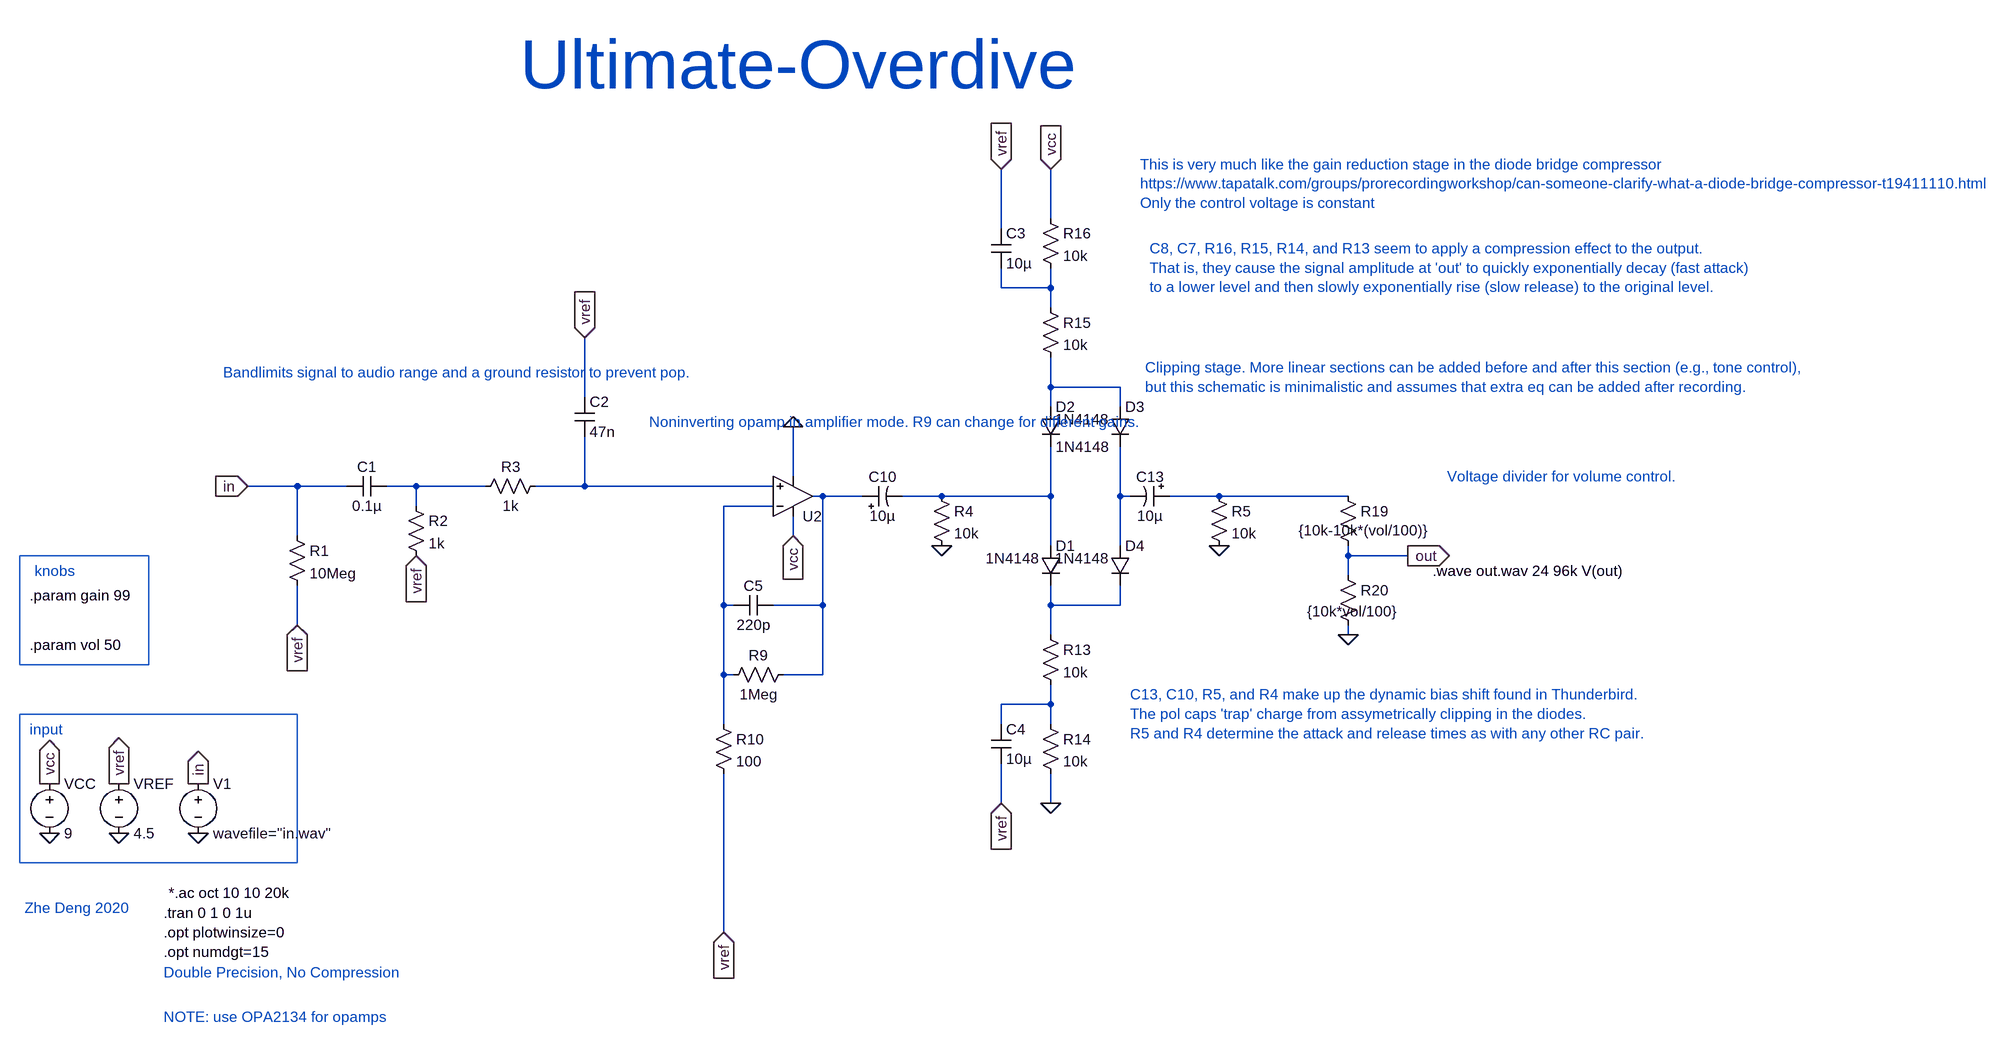
[diagram p0: schematic Ultimate-Overdrive_OLD.asc]
Ultimate-Overdrive_OLD.asc, the LTspice schematic file:
Version 4
SHEET 1 149556 120332
WIRE 146384 115584 146384 115504
WIRE 146304 115600 146304 115504
WIRE 146304 115696 146304 115664
WIRE 146384 115696 146384 115664
WIRE 146384 115696 146304 115696
WIRE 146384 115728 146384 115696
WIRE 146384 115856 146384 115808
WIRE 146496 115856 146384 115856
WIRE 145632 115872 145632 115776
WIRE 146384 115888 146384 115856
WIRE 146496 115888 146496 115856
WIRE 145968 116000 145968 115920
WIRE 145168 116016 145088 116016
WIRE 145248 116016 145168 116016
WIRE 145360 116016 145312 116016
WIRE 145472 116016 145360 116016
WIRE 145632 116016 145632 115936
WIRE 145632 116016 145552 116016
WIRE 145936 116016 145632 116016
WIRE 146016 116032 146000 116032
WIRE 146080 116032 146016 116032
WIRE 146208 116032 146144 116032
WIRE 146384 116032 146384 115952
WIRE 146384 116032 146208 116032
WIRE 146496 116032 146496 115952
WIRE 146512 116032 146496 116032
WIRE 146656 116032 146576 116032
WIRE 146864 116032 146656 116032
WIRE 145360 116048 145360 116016
WIRE 145936 116048 145856 116048
WIRE 145168 116096 145168 116016
WIRE 145968 116096 145968 116064
WIRE 146384 116112 146384 116032
WIRE 146496 116112 146496 116032
WIRE 146864 116128 146864 116112
WIRE 146960 116128 146864 116128
WIRE 146864 116160 146864 116128
WIRE 145856 116208 145856 116048
WIRE 145872 116208 145856 116208
WIRE 146016 116208 146016 116032
WIRE 146016 116208 145936 116208
WIRE 146384 116208 146384 116176
WIRE 146496 116208 146496 116176
WIRE 146496 116208 146384 116208
WIRE 145168 116240 145168 116176
WIRE 146384 116256 146384 116208
WIRE 146864 116256 146864 116240
WIRE 145856 116320 145856 116208
WIRE 145872 116320 145856 116320
WIRE 146016 116320 146016 116208
WIRE 146016 116320 145952 116320
WIRE 146384 116368 146384 116336
WIRE 146384 116368 146304 116368
WIRE 145856 116400 145856 116320
WIRE 146304 116400 146304 116368
WIRE 146384 116400 146384 116368
WIRE 146304 116528 146304 116464
WIRE 146384 116528 146384 116480
WIRE 145856 116736 145856 116480
FLAG 144768 116576 0
FLAG 144880 116576 0
FLAG 144880 116496 vref
IOPIN 144880 116496 Out
FLAG 144768 116496 vcc
IOPIN 144768 116496 Out
FLAG 145008 116496 in
IOPIN 145008 116496 Out
FLAG 145008 116576 0
FLAG 145088 116016 in
IOPIN 145088 116016 In
FLAG 145632 115776 vref
IOPIN 145632 115776 In
FLAG 145968 115920 0
FLAG 145968 116096 vcc
IOPIN 145968 116096 In
FLAG 145856 116736 vref
IOPIN 145856 116736 In
FLAG 146384 116528 0
FLAG 146304 116528 vref
IOPIN 146304 116528 In
FLAG 146304 115504 vref
IOPIN 146304 115504 In
FLAG 146384 115504 vcc
IOPIN 146384 115504 In
FLAG 146864 116256 0
FLAG 146960 116128 out
IOPIN 146960 116128 Out
FLAG 146208 116112 0
FLAG 145360 116128 vref
IOPIN 145360 116128 In
FLAG 146656 116112 0
FLAG 145168 116240 vref
IOPIN 145168 116240 In
SYMBOL voltage 144768 116480 R0
WINDOW 123 0 0 Left 0
WINDOW 39 0 0 Left 0
SYMATTR InstName VCC
SYMATTR Value 9
SYMBOL voltage 144880 116480 R0
WINDOW 123 0 0 Left 0
WINDOW 39 0 0 Left 0
SYMATTR InstName VREF
SYMATTR Value 4.5
SYMBOL res 145152 116080 R0
SYMATTR InstName R1
SYMATTR Value 10Meg
SYMBOL res 145568 116000 R90
WINDOW 0 0 56 VBottom 2
WINDOW 3 32 56 VTop 2
SYMATTR InstName R3
SYMATTR Value 1k
SYMBOL cap 145616 115872 R0
SYMATTR InstName C2
SYMATTR Value 47n
SYMBOL cap 145936 116192 R90
WINDOW 0 0 32 VBottom 2
WINDOW 3 32 32 VTop 2
SYMATTR InstName C5
SYMATTR Value 220p
SYMBOL res 145968 116304 R90
WINDOW 0 0 56 VBottom 2
WINDOW 3 32 56 VTop 2
SYMATTR InstName R9
SYMATTR Value 1Meg
SYMBOL res 145840 116384 R0
SYMATTR InstName R10
SYMATTR Value 100
SYMBOL diode 146368 116112 R0
WINDOW 3 -89 20 Left 2
SYMATTR Value 1N4148
SYMATTR InstName D1
SYMBOL diode 146368 115888 R0
SYMATTR InstName D2
SYMATTR Value 1N4148
SYMBOL res 146368 116240 R0
SYMATTR InstName R13
SYMATTR Value 10k
SYMBOL res 146368 116384 R0
SYMATTR InstName R14
SYMATTR Value 10k
SYMBOL res 146368 115712 R0
SYMATTR InstName R15
SYMATTR Value 10k
SYMBOL res 146368 115568 R0
SYMATTR InstName R16
SYMATTR Value 10k
SYMBOL res 146848 116016 R0
WINDOW 3 -64 71 Left 2
SYMATTR Value {10k-10k*(vol/100)}
SYMATTR InstName R19
SYMBOL res 146848 116144 R0
WINDOW 3 -50 74 Left 2
SYMATTR Value {10k*vol/100}
SYMATTR InstName R20
SYMBOL Opamps\\UniversalOpamp2 145968 116032 M180
SYMATTR InstName U2
SYMBOL voltage 145008 116480 R0
WINDOW 123 0 0 Left 0
WINDOW 39 0 0 Left 0
SYMATTR InstName V1
SYMATTR Value wavefile="in.wav"
SYMBOL polcap 146080 116048 R270
WINDOW 0 32 32 VTop 2
WINDOW 3 0 32 VBottom 2
SYMATTR InstName C10
SYMATTR Value 10µ
SYMBOL polcap 146576 116016 R90
WINDOW 0 0 32 VBottom 2
WINDOW 3 32 32 VTop 2
SYMATTR InstName C13
SYMATTR Value 10µ
SYMBOL diode 146480 115888 R0
WINDOW 3 -89 20 Left 2
SYMATTR Value 1N4148
SYMATTR InstName D3
SYMBOL diode 146480 116112 R0
WINDOW 3 -89 20 Left 2
SYMATTR Value 1N4148
SYMATTR InstName D4
SYMBOL res 145344 116032 R0
SYMATTR InstName R2
SYMATTR Value 1k
SYMBOL cap 145312 116000 R90
WINDOW 0 0 32 VBottom 2
WINDOW 3 32 32 VTop 2
SYMATTR InstName C1
SYMATTR Value 0.1µ
SYMBOL res 146192 116016 R0
SYMATTR InstName R4
SYMATTR Value 10k
SYMBOL res 146640 116016 R0
SYMATTR InstName R5
SYMATTR Value 10k
SYMBOL cap 146288 115600 R0
SYMATTR InstName C3
SYMATTR Value 10µ
SYMBOL cap 146288 116400 R0
SYMATTR InstName C4
SYMATTR Value 10µ
TEXT 144736 116192 Left 2 !.param gain 99
TEXT 144736 116272 Left 2 !.param vol 50
TEXT 144744 116152 Left 2 ;knobs
TEXT 144736 116408 Left 2 ;input
TEXT 144728 116696 Left 2 ;Zhe Deng 2020
TEXT 145528 115336 Left 7 ;Ultimate-Overdive
TEXT 144952 116704 Left 2 !.tran 0 1 0 1u
TEXT 144952 116736 Left 2 !.opt plotwinsize=0\n.opt numdgt=15
TEXT 144952 116800 Left 2 ;Double Precision, No Compression
TEXT 144960 116672 Left 2 !*.ac oct 10 10 20k
TEXT 144952 116872 Left 2 ;NOTE: use OPA2134 for opamps
TEXT 147000 116152 Left 2 !.wave out.wav 24 96k V(out)
TEXT 146544 115632 Left 2 ;C8, C7, R16, R15, R14, and R13 seem to apply a compression effect to the output. \nThat is, they cause the signal amplitude at 'out' to quickly exponentially decay (fast attack) \nto a lower level and then slowly exponentially rise (slow release) to the original level.
TEXT 146512 116352 Left 2 ;C13, C10, R5, and R4 make up the dynamic bias shift found in Thunderbird.\nThe pol caps 'trap' charge from assymetrically clipping in the diodes.\nR5 and R4 determine the attack and release times as with any other RC pair.
TEXT 145048 115832 Left 2 ;Bandlimits signal to audio range and a ground resistor to prevent pop.
TEXT 145736 115912 Left 2 ;Noninverting opamp in amplifier mode. R9 can change for different gains.
TEXT 147024 116000 Left 2 ;Voltage divider for volume control.
TEXT 146536 115824 Left 2 ;Clipping stage. More linear sections can be added before and after this section (e.g., tone control),\nbut this schematic is minimalistic and assumes that extra eq can be added after recording.
TEXT 146528 115496 Left 2 ;This is very much like the gain reduction stage in the diode bridge compressor\nhttps://www.tapatalk.com/groups/prorecordingworkshop/can-someone-clarify-what-a-diode-bridge-compressor-t19411110.html\nOnly the control voltage is constant
RECTANGLE Normal 144928 116304 144720 116128
RECTANGLE Normal 145168 116624 144720 116384

The netlist it stands for:
* Ultimate-Overdrive_OLD.asc
VCC vcc 0 9
VREF vref 0 4.5
R1 in vref 10Meg
R3 N004 N003 1k
C2 vref N004 47n
C5 N005 N009 220p
R9 N005 N009 1Meg
R10 N009 vref 100
D1 N006 N010 1N4148
D2 N002 N006 1N4148
R13 N010 N011 10k
R14 N011 0 10k
R15 N001 N002 10k
R16 vcc N001 10k
R19 N008 out {10k-10k*(vol/100)}
R20 out 0 {10k*vol/100}
XU2 N004 N009 vcc 0 N005 level.2 Avol=1Meg GBW=10Meg Slew=10Meg ilimit=25m rail=0 Vos=0 phimargin=45 en=0 enk=0 in=0 ink=0 Rin=500Meg  ; pins IN+ IN- V+ V- OUT
V1 in 0 wavefile="in.wav"
C10 N005 N006 10µ
C13 N008 N007 10µ
D3 N002 N007 1N4148
D4 N007 N010 1N4148
R2 N003 vref 1k
C1 N003 in 0.1µ
R4 N006 0 10k
R5 N008 0 10k
C3 vref N001 10µ
C4 N011 vref 10µ
.model D D
.lib standard.dio
.param gain 99
.param vol 50
* knobs
* input
* Zhe Deng 2020
* Ultimate-Overdive
.tran 0 1 0 1u
.opt plotwinsize=0
.opt numdgt=15
* Double Precision, No Compression
*.ac oct 10 10 20k
* NOTE: use OPA2134 for opamps
.wave out.wav 24 96k V(out)
* C8, C7, R16, R15, R14, and R13 seem to apply a compression effect to the output.
* That is, they cause the signal amplitude at 'out' to quickly exponentially decay (fast attack)
* to a lower level and then slowly exponentially rise (slow release) to the original level.
* C13, C10, R5, and R4 make up the dynamic bias shift found in Thunderbird.
* The pol caps 'trap' charge from assymetrically clipping in the diodes.
* R5 and R4 determine the attack and release times as with any other RC pair.
* Bandlimits signal to audio range and a ground resistor to prevent pop.
* Noninverting opamp in amplifier mode. R9 can change for different gains.
* Voltage divider for volume control.
* Clipping stage. More linear sections can be added before and after this section (e.g., tone control),
* but this schematic is minimalistic and assumes that extra eq can be added after recording.
* This is very much like the gain reduction stage in the diode bridge compressor
* https://www.tapatalk.com/groups/prorecordingworkshop/can-someone-clarify-what-a-diode-bridge-compressor-t19411110.html
* Only the control voltage is constant
.lib UniversalOpamps2.sub
.backanno
.end